# EAGLE design SparkFun_Buck_Regulator_AP63357DV-7_Buck5V (EAGLE 9.6.2)
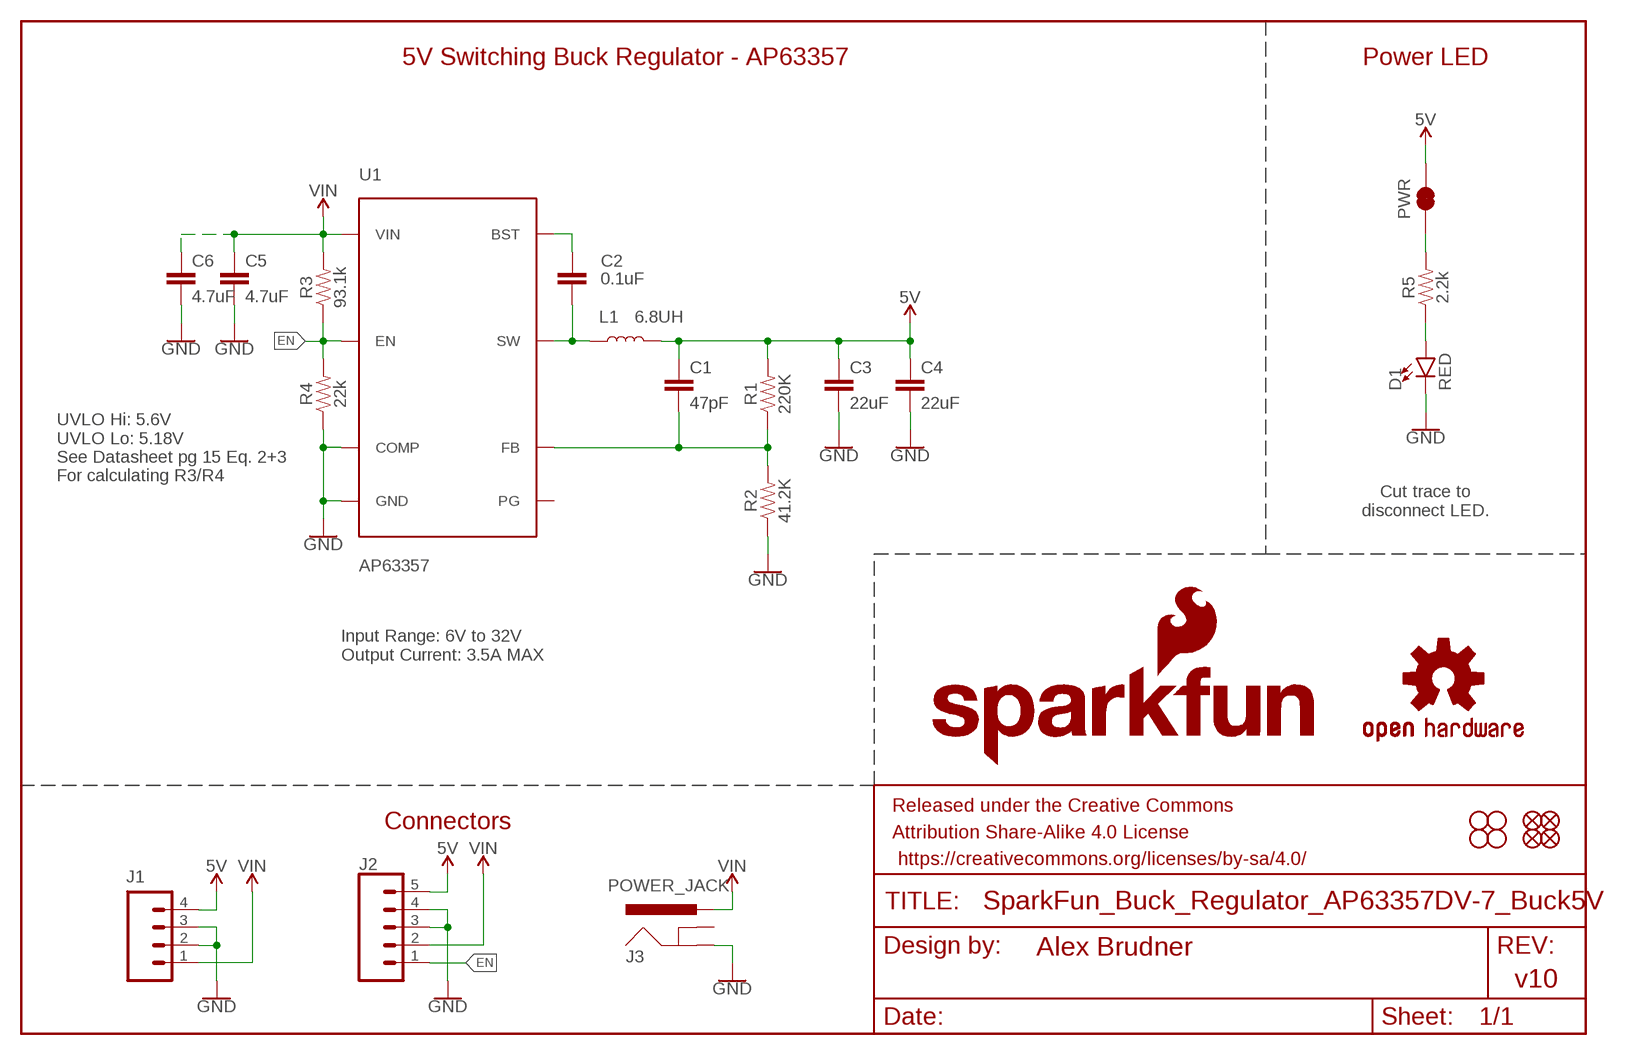
[diagram p0: schematic, sheet 1]

## Parts
C1  47pF  47PF-0402_TIGHT-25V-5%-X7R  [0402-TIGHT]
C2  0.1uF  0.1UF-0402T-16V-10%  [0402-TIGHT]
C3  22uF  22UF-0805-16V-20%  [0805]
C4  22uF  22UF-0805-16V-20%  [0805]
C5  4.7uF  4.7UF-0805-50V-(10%)  [0805]
C6  4.7uF  4.7UF-0805-50V-(10%)  [0805]
D1  RED  LED-RED0603  [LED-0603]
FD1  FIDUCIALUFIDUCIAL  [FIDUCIAL-MICRO]
FD2  FIDUCIALUFIDUCIAL  [FIDUCIAL-MICRO]
FD3  FIDUCIALUFIDUCIAL  [FIDUCIAL-MICRO]
FD4  FIDUCIALUFIDUCIAL  [FIDUCIAL-MICRO]
FRAME1  FRAME-LEDGER  [CREATIVE_COMMONS]
H1  STAND-OFF  [STAND-OFF]
H2  STAND-OFF  [STAND-OFF]
H3  STAND-OFF  [STAND-OFF]
H4  STAND-OFF  [STAND-OFF]
J1  CONN_04SCREW  [SCREWTERMINAL-3.5MM-4]
J2  CONN_05NO_SILK  [1X05_NO_SILK]
J3  POWER_JACK  POWER_JACKPOWER_JACK_SLOT_NO_SILK_OVRHNG  [POWER_JACK_PTH_SLOT_NO_OVRHNG_SILK]
L1  6.8UH  [07A7_6U8H]
LOGO1  OSHW-LOGOMINI  [OSHW-LOGO-MINI]
LOGO2  SFE_LOGO_NAME_FLAME.1_INCH  [SFE_LOGO_NAME_FLAME_.1]
PWR  JUMPER-SMT_2_NC_TRACE_SILK  [SMT-JUMPER_2_NC_TRACE_SILK]
R1  220K  220KOHM-0402T-1/16W-1%  [0402-TIGHT]
R2  41.2K  41.2KOHM-0402-1/16W-1%(41.2KOHM)  [0402-TIGHT]
R3  93.1k  93.1KOHM-0402-1/16W-1%(93.1KOHM)  [0402-TIGHT]
R4  22k  22KOHM-0402_TIGHT-1/10W-1%  [0402-TIGHT]
R5  2.2k  2.2KOHM-0402T-1/16W-1%  [0402-TIGHT]
U1  AP63357  [V-DFN3020-13]

## Nets
5V: C1.1 C3.1 C4.1 J1.4 J2.5 L1.P$2 PWR.2 R1.2
EN: J2.1 R3.1 R4.2 U1.P$2(EN)
FB: C1.2 R1.1 R2.2 U1.P$3(FB)
GND: C3.2 C4.2 C5.2 C6.2 D1.C J1.2 J1.3 J2.3 J2.4 J3.GND R2.1 R4.1 U1.P$4(COMP) U1.P$8(GND)
N$2: D1.A R5.1
N$4: C2.1 U1.P$6(BST)
N$5: PWR.1 R5.2
SW: C2.2 L1.P$1 U1.P$7(SW) U1.P$9(SW)
VIN: C5.1 C6.1 J1.1 J2.2 J3.PWR R3.2 U1.P$1(VIN)
Unconnected: J3.GNDBREAK U1.P$5(PG)

## Notes on the sheet
- 5V Switching Buck Regulator - AP63357 | Power LED
- UVLO Hi: 5.6V
  UVLO Lo: 5.18V
  See Datasheet pg 15 Eq. 2+3 
  For calculating R3/R4
- Cut trace to
  disconnect LED.
- Input Range: 6V to 32V
  Output Current: 3.5A MAX
- Connectors

## Library data of the parts
C1 = SparkFun-Capacitors:47PF: 47pF ceramic capacitors A capacitor is a passive two-terminal electrical component used to store electrical energy temporarily in an electric field.; PROD_ID: CAP-15063
C2 = SparkFun-Capacitors:0.1UF: 0.1µF ceramic capacitors A capacitor is a passive two-terminal electrical component used to store electrical energy temporarily in an electric field.; PROD_ID: CAP-12416
C3 C4 = SparkFun-Capacitors:22UF: 22µF ceramic capacitors A capacitor is a passive two-terminal electrical component used to store electrical energy temporarily in an electric field.; PROD_ID: CAP-14260
C5 C6 = SparkFun-Capacitors:4.7UF: 4.7µF ceramic capacitors A capacitor is a passive two-terminal electrical component used to store electrical energy temporarily in an electric field.; PROD_ID: CAP-15457
D1 = SparkFun-LED:LED-RED: Red SMD LED Used in manufacturing of most products at SparkFun Packages: 0603 - SMD 0603 package [Product Link] <http://docs.avagotech.com/docs/AV02-0551EN> 0603 SMART - SMD 0603 SMART package ( more efficient and expensive)[Product Link] <http://www.osram-os.com/Graphics/XPic2/00077099_0.pdf> 1206 - SMD1206 package [Product Link] <https://www.sparkfun.com/datasheets/DevTools/LilyPad/Q150OVS4.pdff> SparkFun Products: Pro Mini 328 -5V <https://www.sparkfun.com/products/821> RedBoard <https://www.sparkfun.com/products/12757> IOIO-OTG <https://www.sparkfun.com/products/13613>; PROD_ID: DIO-00819
FD1-FD4 = SparkFun-Aesthetics:FIDUCIAL: Fiducial Alignment Points Point-of-reference for pick-and-place machines and other optical instruments.
FRAME1 = SparkFun-Aesthetics:FRAME-LEDGER: Schematic Frame - Ledger Standard 11x14 US Ledger frame; DESIGNER: Alex Brudner; REV: v10
H1-H4 = SparkFun-Hardware:STAND-OFF: Stand Off Drill holes for mechanically mounting via screws, standoffs, etc. Note: Use the keepout ring to avoid running the screw head into surrounding components. Variant Overviews STAND-OFF - Mechanical footprint for a #4 phillips button head screw. STAND-OFF-TIGHT - Mechanical footprint for a #4 phillips button head screw, Example SparkFun Products Screw - Phillips Head (1/4", 4-40, 10 pack) <https://www.sparkfun.com/products/10453> (PRT-10453) Screw - Phillips Head (1/2", 4-40, 10 pack) <https://www.sparkfun.com/products/10452> (PRT-10452) Screw - Phillips Head (3/4", 4-40, 10 pack) <https://www.sparkfun.com/products/10451> (PRT-10451) Screw - Phillips Head (1", 4-40, 10 pack) <https://www.sparkfun.com/products/10450> (PRT-10450)
J1 = SparkFun-Connectors:CONN_04: Multi connection point. Often used as Generic Header-pin footprint for 0.1 inch spaced/style header connections On any of the 0.1 inch spaced packages, you can populate with these: Break Away Headers - Straight <https://www.sparkfun.com/products/116> (PRT-00116) Break Away Male Headers - Right Angle <https://www.sparkfun.com/products/553> (PRT-00553) Female Headers <https://www.sparkfun.com/products/115> (PRT-00115) Break Away Headers - Machine Pin <https://www.sparkfun.com/products/117> (PRT-00117) Break Away Female Headers - Swiss Machine Pin <https://www.sparkfun.com/products/743> (PRT-00743) For SCREWTERMINALS and SPRING TERMINALS visit here: Screw Terimnals on SparkFun.com <https://www.sparkfun.com/search/results?term=Screw+Terminals> (5mm/3.5mm/2.54mm spacing) This device is also useful as a general connection point to wire up your design to another part of your project. Our various solder wires solder well into these plated through hole pads. Hook-Up Wire - Assortment (Stranded, 22 AWG) <https://www.sparkfun.com/products/11375> (PRT-11375) Hook-Up Wire - Assortment (Solid Core, 22 AWG) <https://www.sparkfun.com/products/11367> (PRT-11367) View the entire wire category on our website here <https://www.sparkfun.com/categories/141> Special notes: Molex polarized connector foot print use with SKU : PRT-08231 with associated crimp pins and housings. 1MM SMD Version SKU: PRT-10208; PROD_ID: CONN-14485
J2 = SparkFun-Connectors:CONN_05: Multi connection point. Often used as Generic Header-pin footprint for 0.1 inch spaced/style header connections On any of the 0.1 inch spaced packages, you can populate with these: Break Away Headers - Straight <https://www.sparkfun.com/products/116> (PRT-00116) Break Away Male Headers - Right Angle <https://www.sparkfun.com/products/553> (PRT-00553) Female Headers <https://www.sparkfun.com/products/115> (PRT-00115) Break Away Headers - Machine Pin <https://www.sparkfun.com/products/117> (PRT-00117) Break Away Female Headers - Swiss Machine Pin <https://www.sparkfun.com/products/743> (PRT-00743) For SCREWTERMINALS and SPRING TERMINALS visit here: Screw Terimnals on SparkFun.com <https://www.sparkfun.com/search/results?term=Screw+Terminals> (5mm/3.5mm/2.54mm spacing) This device is also useful as a general connection point to wire up your design to another part of your project. Our various solder wires solder well into these plated through hole pads. Hook-Up Wire - Assortment (Stranded, 22 AWG) <https://www.sparkfun.com/products/11375> (PRT-11375) Hook-Up Wire - Assortment (Solid Core, 22 AWG) <https://www.sparkfun.com/products/11367> (PRT-11367) View the entire wire category on our website here <https://www.sparkfun.com/categories/141> Special notes: Molex polarized connector foot print use with SKU : PRT-08231 with associated crimp pins and housings. 1MM SMD Version SKU: PRT-10208
J3 = SparkFun-Connectors:POWER_JACK: Power Jack Connector This is the standard 5.5mm barrel jack for power. The PTH is the most common, proven, reliable, footprint. The Slot footprint only works if the mill layer is transmitted to the PCB fab house so be warned. Here are the connectors we sell at SparkFun: DC Barrel Power Jack/Connector <https://www.sparkfun.com/products/119> (PRT-00119) DC Barrel Power Jack/Connector (SMD) <https://www.sparkfun.com/products/12748> (PRT-12748) DC Barrel Jack Adapter - Breadboard Compatible <https://www.sparkfun.com/products/10811> (PRT-10811) It is used on this SparkFun product (and many, many others): SparkFun RedBoard - Programmed with Arduino <https://www.sparkfun.com/products/12757> (DEV-12757) Also, if you need a mating power supply or connector, please check these out: Wall Adapter Power Supply - 9VDC 650mA <https://www.sparkfun.com/products/298> (TOL-00298) DC Barrel Jack Adapter - Male <https://www.sparkfun.com/products/10287> (PRT-10287)
L1 = Buck5V:6.8UH; PN: LMLP07A7M6R8DTAS; PROD_ID: NDUC-17223
LOGO1 = SparkFun-Aesthetics:OSHW-LOGO: Open-Source Hardware (OSHW) Logo This logo indicates the piece of hardware it is found on incorporates a OSHW license and/or adheres to the definition of open source hardware found here: http://freedomdefined.org/OSHW
LOGO2 = SparkFun-Aesthetics:SFE_LOGO_NAME_FLAME: SparkFun Font Logo w/ Flame This is the SparkFun full logo. The logo on the schematic will always be the same size; the package variant is the height of the flame part of the logo. Default layer for the logo on the board is tSilk.
PWR = SparkFun-Jumpers:JUMPER-SMT_2_NC_TRACE: Normally closed trace jumper This jumper has a trace between two pads so it's normally closed (NC). Use a razor knife to open the connection. For best results follow the IPC guidelines for cutting traces: Cutout at least 0.063 mm (0.005 in). Remove all loose material to clean up the cut area. Seal the cut with an approved epoxy. Reapply solder to reclose the connection.
R1 = SparkFun-Resistors:220KOHM: 220kΩ resistor A resistor is a passive two-terminal electrical component that implements electrical resistance as a circuit element. Resistors act to reduce current flow, and, at the same time, act to lower voltage levels within circuits. - Wikipedia; PROD_ID: RES-15094
R2 = Buck5V:41.2KOHM; PN: RC0402FR-0741K2L; PROD_ID: RES-15010
R3 = Buck5V:93.1KOHM; PN: RC0402FR-0793K1L; PROD_ID: RES-17226
R4 = SparkFun-Resistors:22KOHM: 22kΩ resistor A resistor is a passive two-terminal electrical component that implements electrical resistance as a circuit element. Resistors act to reduce current flow, and, at the same time, act to lower voltage levels within circuits. - Wikipedia; PROD_ID: RES-14281
R5 = SparkFun-Resistors:2.2KOHM: 2.2kΩ resistor A resistor is a passive two-terminal electrical component that implements electrical resistance as a circuit element. Resistors act to reduce current flow, and, at the same time, act to lower voltage levels within circuits. - Wikipedia; PROD_ID: RES-14341
U1 = Buck5V:AP63357: The AP63356/AP63357 is a 3.5A, synchronous buck converter with a wide input voltage range of 3.8V to 32V. The device fully integrates a 74mΩ high-side power MOSFET and a 40mΩ low-side power MOSFET to provide high-efficiency step-down DC-DC conversion.; PN: AP63357DV-7; PROD_ID: VREG-17224

## Board
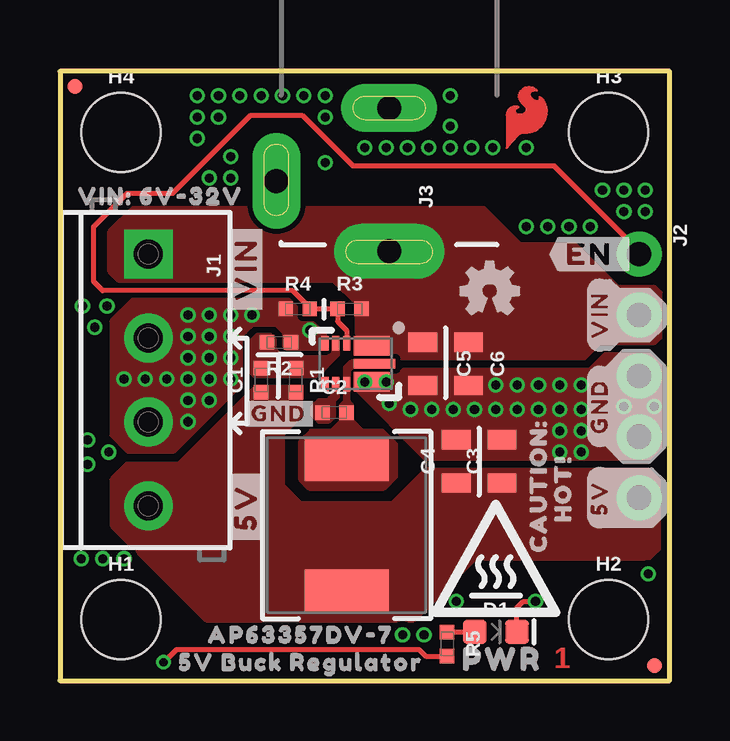
[diagram p1: board, top side]
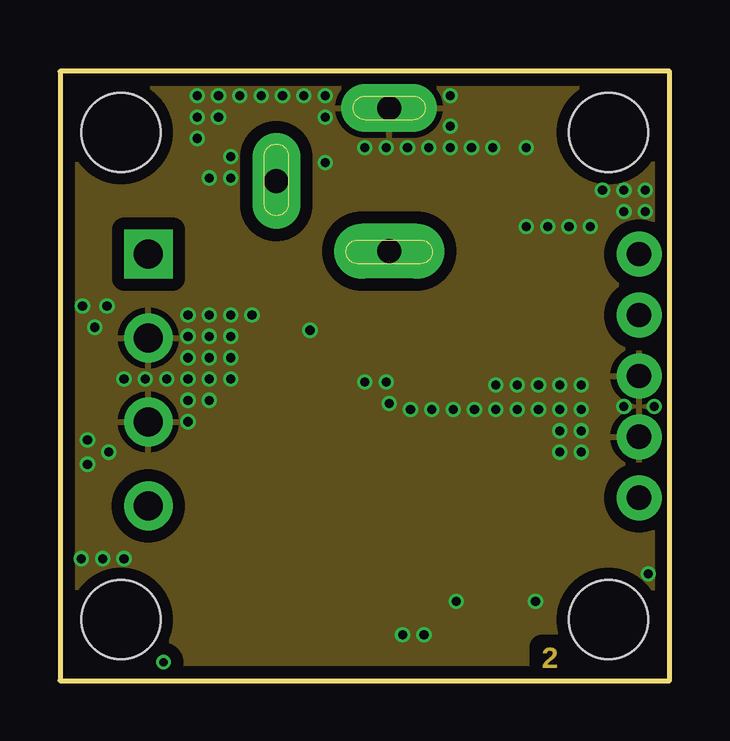
[diagram p2: board, inner layer Route2]
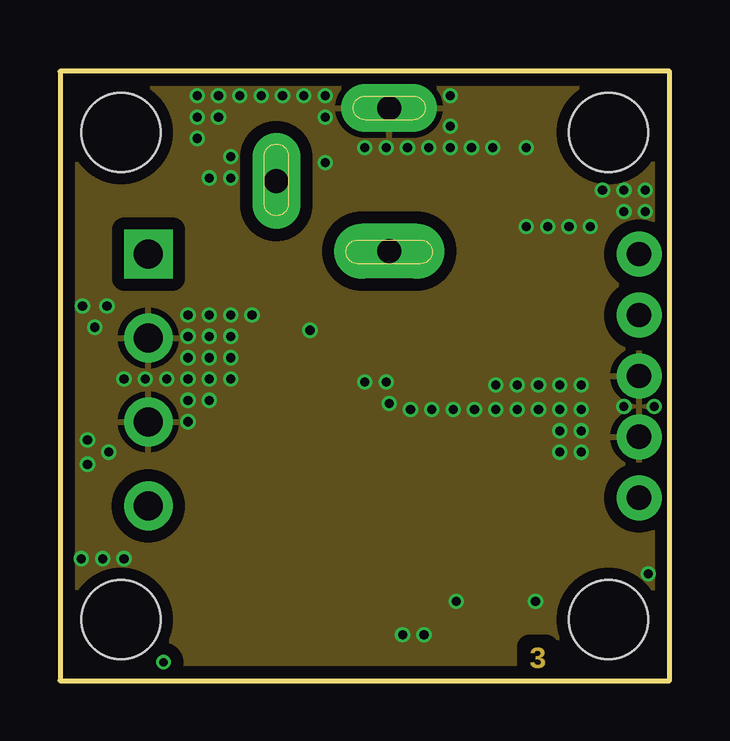
[diagram p3: board, inner layer Route15]
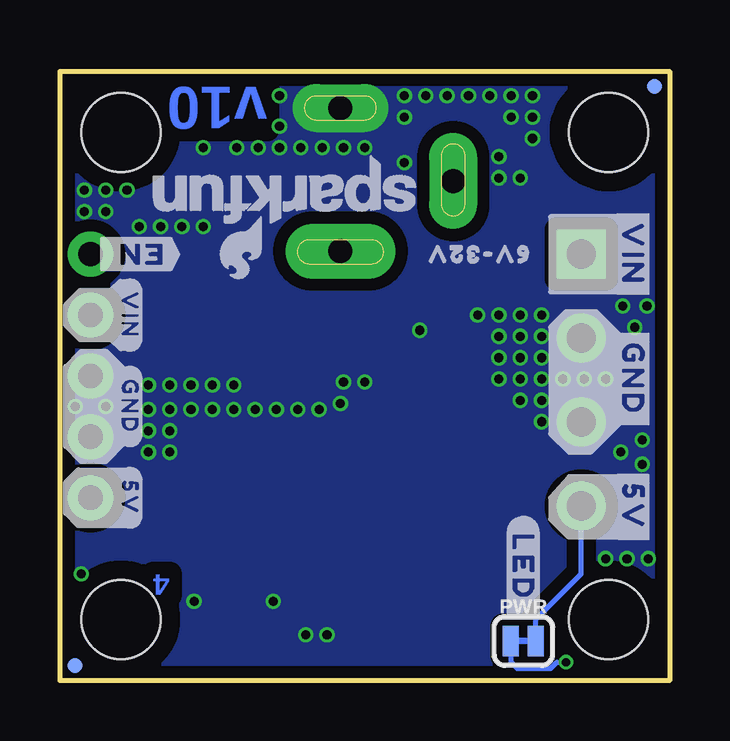
[diagram p4: board, bottom side, seen from below]

Size 25.4 x 25.4 mm. Coordinates in mm from the lower left corner, seen from the top.
Outline: 0,0 25.4,0 25.4,25.4 0,25.4 0,0
Copper layers (1*2*15*16): Top 0.035559375mm / dielectric 0.47751875mm / Route2 0.035559375mm / dielectric 0.47751875mm / Route15 0.035559375mm / dielectric 0.47751875mm / Bottom 0.035559375mm
Design rules "SparkFun-4-Layer-Minimum-JLCPCB": minimum track width 5mil, minimum drill 0.2mm, track to track 5mil, track to pad 5mil, pad to pad 5mil, via to via 5mil, smd to smd 5mil, copper to edge 7mil, drill to drill 7mil, minimum pad ring 5mil, minimum via ring 5mil, stop-mask expansion 2.5mil, vias tented up to drill 25mil, thermal gap 10mil

### Footprints (pad centres in the part's own frame; a part is rotated, then mirrored left to right if it is on the bottom)
0402-TIGHT = smd 0.6 x 0.6: 1 -0.5,0; 2 0.5,0
0805 = smd 0.8 x 1.2: 1 -0.9,0; 2 0.9,0
LED-0603 = smd 1 x 1: A -0.877,0; C 0.877,0
FIDUCIAL-MICRO = smd 0.635 x 0.635: 1 0,0
STAND-OFF = hole 3.302: 0,0
SCREWTERMINAL-3.5MM-4 = drill 1.2 pad 2.032 square: 1 0,0 | drill 1.2 pad 2.032: 2 3.5,0; 3 7,0; 4 10.5,0
1X05_NO_SILK = drill 1.016 pad 1.88: 1 0,0; 2 2.54,0; 3 5.08,0; 4 7.62,0; 5 10.16,0
POWER_JACK_PTH_SLOT_NO_OVRHNG_SILK = drill 1 pad 2 long: GND 0,0; GNDBREAK -3.048,4.699 | drill 1 pad 2.3 long: PWR -5.969,0
07A7_6U8H = smd 1.85 x 3.5: P$1 -2.775,0; P$2 2.775,0
SMT-JUMPER_2_NC_TRACE_SILK = smd 0.66 x 1.27: 1 -0.521,0; 2 0.521,0
V-DFN3020-13 = smd 1.5 x 0.8: P$1 -0.675,-0.75; P$8 -0.675,0.75 | smd 0.3 x 0.6: P$2 0.375,-0.85; P$3 0.825,-0.85; P$4 1.275,-0.85; P$5 1.275,0.85; P$6 0.825,0.85; P$7 0.375,0.85 | smd 1.73 x 0.4: P$9 -0.79,0

### Placement (x,y rotation side)
C1  8.38,12.52 90 top
C2  11.43,11.18 0 top
C3  18.41,9.14 90 top
C4  16.51,9.14 90 top
C5  15.11,13.21 270 top
C6  17.02,13.21 270 top
D1  18.16,2.03 0 top
FD1  24.77,0.64 0 top
FD2  0.64,24.77 0 top
FD3  24.77,0.64 0 bottom
FD4  0.64,24.77 0 bottom
FRAME1  21.21,-16.38 0 top  (outside the outline)
H1  2.54,2.54 0 top
H2  22.86,2.54 0 top
H3  22.86,22.86 0 top
H4  2.54,22.86 0 top
J1  3.68,17.78 270 top
J2  24.13,17.78 270 top
J3  13.72,23.88 90 top
L1  11.94,6.48 270 top
LOGO1  17.91,16.26 0 top
LOGO2  16.13,20.45 180 bottom
PWR  6.1,1.65 0 bottom
R1  9.83,12.52 270 top
R2  9.13,14.1 180 top
R3  12.06,15.49 0 top
R4  9.91,15.49 0 top
R5  16.13,1.52 270 top
U1  12.32,13.21 180 top
U$1  [AP63357DV#70]  10.03,1.91 0 top
U$2  [5V_BUCK_REGULATOR0]  10.03,0.76 0 top
U$3  [#5V#4]  7.75,7.24 90 top
U$4  [#VIN#8]  1.52,17.78 270 bottom
U$5  [#VIN#0]  22.48,15.24 90 top
U$6  [#GND#0]  22.48,11.43 90 top
U$7  [#GND#0]  22.48,11.43 270 bottom
U$8  [#EN_#0]  22.23,17.78 0 top
U$9  [#GND#9]  1.52,12.57 270 bottom
U$10  [#5V#10]  1.52,7.24 270 bottom
U$11  [6V#32V10]  8,17.78 180 bottom
U$12  [HOT##0]  20.95,8 90 top
U$13  [#VIN#0]  22.48,15.24 270 bottom
U$14  [#5V#0]  22.48,7.62 270 bottom
U$15  [#LED_#0]  6.1,4.57 270 bottom
U$16  [CAUTION#0]  19.94,8.13 90 top
U$17  [SFE_LOGO_FLAME_COPPER_EXPOSED_.1]  19.43,23.5 0 top
U$18  [VIN#_6V#32V0]  4.19,20.19 0 top
U$19  [#EN_#0]  22.23,17.78 180 bottom
U$20  [PWR0]  18.41,0.89 0 top
U$21  [#GND#1]  9.11,11.13 0 top
U$22  [HIGH_TEMP_WARNING]  18.16,4.45 0 top
U$23  [ORDERING_INSTRUCTIONS]  35.56,43.05 0 top  (outside the outline)
U$24  [#5V#0]  22.48,7.62 90 top
U$26  [#VIN#3]  7.75,17.14 90 top

### Tracks (layer width: path | path; a pad name or v marks a point on that pad's centre or on a via)
5V
  Bottom 0.203: PWR.2 5.58,2.55 3.68,4.45 J1.4
  pour Top (isolate 0.254, no thermals): 9.27,8.13 9.27,10.29 10.03,11.05 10.03,12.22 8.16,12.22 4.95,9.02 2.79,9.02 2.16,8.38 2.16,6.48 6.1,2.54 14.73,2.54 17.3,5.11 24.54,5.11 25.15,5.71 25.15,8.13 24.51,8.76 15.24,8.76 13.84,7.37 10.03,7.37
EN
  Top 0.203: U1.P$2 11.94,14.6 11.56,14.98 R3.1 R4.2 10.41,15.54 9.69,16.26 1.78,16.26 1.4,16.64 1.4,18.92 2.79,20.32 4.7,20.32 7.94,23.57 10.09,23.57 12.19,21.46 20.57,21.46 24.13,17.91 J2.1
FB
  pour Top (rank 2, no thermals): 11.43,14.22 11.56,14.22 11.56,13.59 10.67,12.7 8.13,12.7 7.97,12.86 7.97,14.14 8.24,14.41 8.75,14.41 8.91,14.24 8.91,13.82 9.26,13.47 11.19,13.47 11.43,13.72
GND  (via drill 0.38)
  Top 0.203: D1.C 19.04,3.04 19.3,3.3 v19.81,3.3
  other vias: 12.7,12.45 13.59,12.45 13.72,11.56 14.61,11.3 15.49,11.3 16.38,11.3 17.27,11.3 18.16,11.3 18.16,12.32 19.05,12.32 19.05,11.3 19.94,11.3 19.94,12.32 24.77,11.43 10.41,14.61 2.67,12.57 3.56,12.57 4.45,12.57 5.33,10.79 5.33,11.68 6.22,11.68 7.11,12.57 6.22,12.57 5.33,12.57 5.33,13.46 5.33,14.35 5.33,15.24 6.22,15.24 6.22,14.35 6.22,13.46 7.11,13.46 7.11,14.35 7.11,15.24 8,15.24 16.26,24.38 16.26,23.11 18.03,22.23 15.37,22.23 16.26,22.23 17.14,22.23 12.7,22.23 13.59,22.23 14.48,22.23 19.43,22.23 9.27,24.38 10.16,24.38 11.05,24.38 11.05,23.5 6.6,24.38 7.49,24.38 8.38,24.38 22.61,20.45 23.5,20.45 24.38,20.45 24.38,19.56 23.5,19.56 22.1,18.92 21.21,18.92 20.32,18.92 19.43,18.92 11.05,21.59 7.11,21.84 7.11,20.95 6.22,20.95 5.71,22.61 5.71,23.5 5.71,24.38 6.6,23.5 0.89,5.08 1.78,5.08 2.67,5.08 16.51,3.3 24.51,4.45 23.5,11.43 20.83,10.41 20.83,11.3 20.83,12.32 21.72,10.41 21.72,11.3 21.72,12.32 21.72,9.53 1.45,14.73 1.14,10.03 1.14,9.02 20.83,9.53 0.94,15.62 1.96,15.62 2.03,9.53 14.27,1.91 15.16,1.91
  pour Route2 (isolate 0.508, rank 2): -0.13,25.53 25.53,25.53 25.53,-0.13 -0.13,-0.13
  pour Route15 (isolate 0.508, rank 2): -0.13,25.53 25.53,25.53 25.53,-0.13 -0.13,-0.13
  pour Top (isolate 0.203, rank 2, no thermals): 11.1,13.86 11.1,14.32 10.56,14.86 10.03,14.86 9.91,14.99 9.91,15.88 9.27,15.88 3.05,15.87 2.16,14.99 2.16,10.24 2.81,9.58 4.74,9.58 7.52,12.36 7.52,14.38 8,14.86 9.02,14.86 9.34,14.53 9.34,13.96 9.44,13.86
  pour Top (isolate 0.203, rank 3, no thermals): 12.35,12.76 14.15,12.76 14.35,12.95 22.1,12.95 22.73,13.59 24.51,13.59 25.15,12.95 25.15,9.91 24.51,9.27 15.24,9.27 12.35,12.16
  pour Bottom (isolate 0.508, rank 3, no thermals): -0.13,25.53 25.53,25.53 25.53,-0.13 -0.13,-0.13
N$2
  Top 0.203: R5.1 16.14,2.03 D1.A
N$4
  pour Top (rank 3, no thermals): 10.79,10.79 10.54,11.05 10.54,11.43 10.79,11.68 11.18,11.68 11.43,11.94 11.43,12.57 11.56,12.57 11.56,11.18 11.18,10.79
N$5  (via drill 0.35)
  Top 0.203: v4.32,0.76 4.86,1.3 14.95,1.3 15.24,1.02 R5.2
  Bottom 0.203: PWR.1 6.62,0.78 6.35,0.51 4.95,0.51 4.7,0.76 v4.32,0.76
SW
  pour Top (rank 2, no thermals): 12.16,13.3 13.87,13.3 13.87,13.11 12.38,13.11 11.99,12.73 11.99,11.63 12.13,11.49 12.13,10.84 12.55,10.41 13.4,10.41 13.97,9.84 13.97,8.51 13.46,8 10.41,8 10.03,8.38 10.03,9.97 10.48,10.41 11.34,10.41 11.73,10.81 11.73,11.48 11.9,11.65 11.9,13.04
VIN
  pour Top (isolate 0.203, no thermals): 3.05,19.68 2.06,18.7 2.06,17.08 2.44,16.71 11.41,16.71 12.36,15.75 12.36,14.06 12.95,13.46 21.84,13.46 22.48,14.1 24.77,14.1 25.15,14.48 25.15,16 24.77,16.38 23.24,16.38 21.46,18.16 19.18,18.16 17.65,19.68

### Text on the board
Top: 1
Route2: 2
Route15: 3
Bottom: v10 | 4
Measures: UNITS IN INCHES
tDocu: Board thickness is 0.8mm / 4-Layer / 1oz copper outer / 1oz copper inner | Alex Brudner